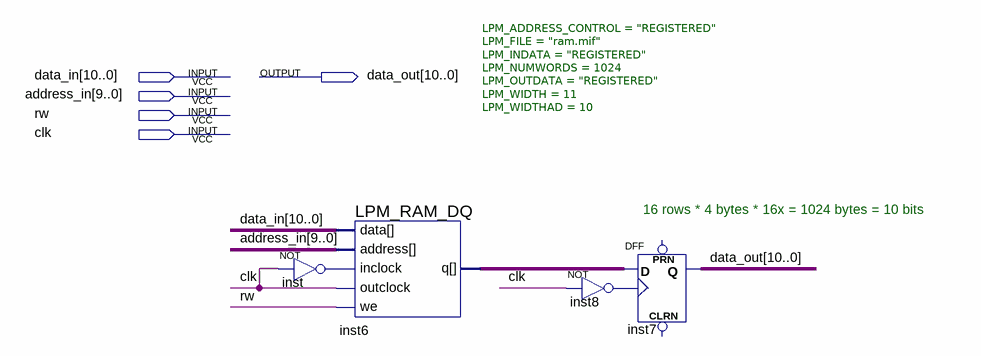
[diagram p0: schematic sheet]
// Quartus schematic memory.bdf as structural Verilog: 4 symbols, 5 pins
module memory (
  input  [10:0] data_in,
  input  [9:0] address_in,
  input  rw,
  input  clk,
  output [10:0] data_out
);

  wire inst8_out, inst_out;
  wire [10:0] inst6_q;

  not inst (inst_out, clk);
  LPM_RAM_DQ #(.LPM_ADDRESS_CONTROL("REGISTERED"), .LPM_FILE("ram.mif"), .LPM_INDATA("REGISTERED"), .LPM_NUMWORDS(1024), .LPM_OUTDATA("REGISTERED"), .LPM_WIDTH(11), .LPM_WIDTHAD(10)) inst6 (
    .inclock(inst_out), .data(data_in), .address(address_in), .we(rw), .outclock(clk), .q(inst6_q));
  not inst8 (inst8_out, clk);
  DFF inst7[10:0] (.CLK(inst8_out), .D(inst6_q), .Q(data_out));  // open: CLRN, PRN

  // Notes on the sheet:
  //   16 rows * 4 bytes * 16x = 1024 bytes = 10 bits
endmodule
